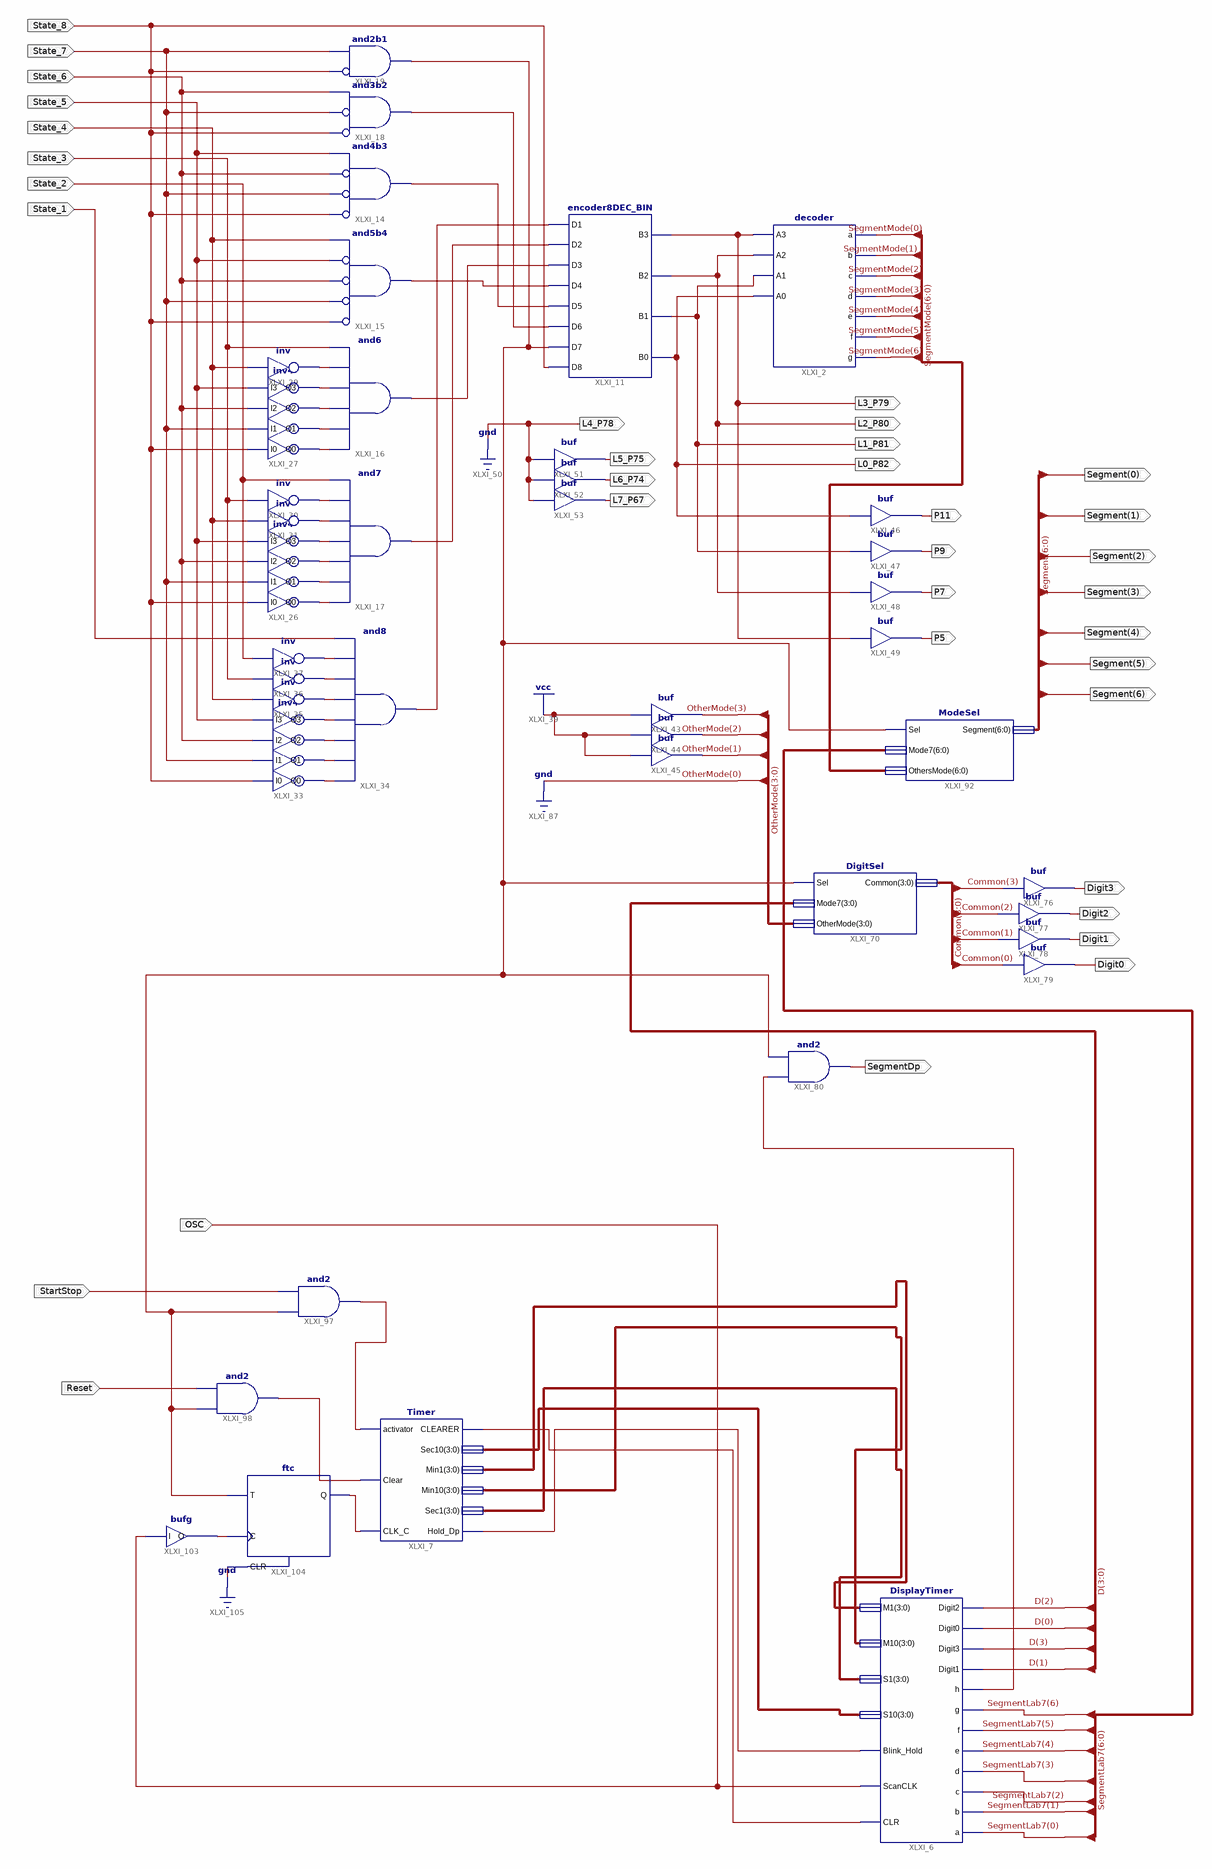
[diagram p0: schematic sheet 1]
// Xilinx ISE schematic Main.sch (spartan6) as structural Verilog: 41 symbols, 35 ports
module Main (
  input  State_7,
  input  State_8,
  input  State_4,
  input  State_5,
  input  State_6,
  input  State_1,
  input  State_2,
  input  State_3,
  input  OSC,
  input  StartStop,
  input  Reset,
  output L1_P81,
  output L0_P82,
  output L2_P80,
  output L3_P79,
  output P11,
  output P9,
  output P7,
  output P5,
  output L4_P78,
  output L5_P75,
  output L6_P74,
  output L7_P67,
  output Digit3,
  output Digit2,
  output Digit1,
  output Digit0,
  output SegmentDp,
  output [6:0] Segment
);

  wire XLXN_28, XLXN_29, XLXN_30, XLXN_31, XLXN_32, XLXN_33, XLXN_34, XLXN_35, XLXN_40, XLXN_41, XLXN_42,
       XLXN_68, XLXN_69, XLXN_70, XLXN_71, XLXN_72, XLXN_73, XLXN_74, XLXN_97, XLXN_98, XLXN_106, XLXN_107,
       XLXN_108, XLXN_109, XLXN_110, XLXN_111, XLXN_183, XLXN_234, XLXN_235, XLXN_236, XLXN_259, XLXN_260;
  wire [3:0] Common, D, XLXN_1, XLXN_2, XLXN_3, XLXN_4;
  wire [3:1] OtherMode;
  wire [6:0] SegmentLab7, SegmentMode;

  decoder XLXI_2 (
    .a(SegmentMode[0]), .b(SegmentMode[1]), .c(SegmentMode[2]), .d(SegmentMode[3]), .e(SegmentMode[4]),
    .f(SegmentMode[5]), .g(SegmentMode[6]), .A3(L3_P79), .A2(L2_P80), .A1(L1_P81), .A0(L0_P82));
  encoder8DEC_BIN XLXI_11 (
    .D1(XLXN_111), .D2(XLXN_110), .D3(XLXN_109), .D4(XLXN_108), .D5(XLXN_107), .D6(XLXN_106), .D7(XLXN_234),
    .D8(State_8), .B3(L3_P79), .B2(L2_P80), .B1(L1_P81), .B0(L0_P82));
  and XLXI_14 (XLXN_107, ~State_8, ~State_7, ~State_6, State_5);  // and4b3
  and XLXI_15 (XLXN_108, ~State_8, ~State_7, ~State_6, ~State_5, State_4);  // and5b4
  and XLXI_16 (XLXN_109, XLXN_32, XLXN_33, XLXN_34, XLXN_35, XLXN_40, State_3);
  and XLXI_17 (XLXN_110, XLXN_28, XLXN_29, XLXN_30, XLXN_31, XLXN_42, XLXN_41, State_2);
  and XLXI_18 (XLXN_106, ~State_8, ~State_7, State_6);  // and3b2
  and XLXI_19 (XLXN_234, ~State_8, State_7);  // and2b1
  inv4 XLXI_26 (
    .I0(State_8), .I1(State_7), .I2(State_6), .I3(State_5), .O0(XLXN_28), .O1(XLXN_29), .O2(XLXN_30),
    .O3(XLXN_31));
  inv4 XLXI_27 (
    .I0(State_8), .I1(State_7), .I2(State_6), .I3(State_5), .O0(XLXN_32), .O1(XLXN_33), .O2(XLXN_34),
    .O3(XLXN_35));
  not XLXI_29 (XLXN_40, State_4);
  not XLXI_30 (XLXN_41, State_3);
  not XLXI_31 (XLXN_42, State_4);
  inv4 XLXI_33 (
    .I0(State_8), .I1(State_7), .I2(State_6), .I3(State_5), .O0(XLXN_68), .O1(XLXN_69), .O2(XLXN_70),
    .O3(XLXN_71));
  and XLXI_34 (XLXN_111, XLXN_68, XLXN_69, XLXN_70, XLXN_71, XLXN_72, XLXN_73, XLXN_74, State_1);
  not XLXI_35 (XLXN_72, State_4);
  not XLXI_36 (XLXN_73, State_3);
  not XLXI_37 (XLXN_74, State_2);
  buf XLXI_46 (P11, L0_P82);
  buf XLXI_47 (P9, L1_P81);
  buf XLXI_48 (P7, L2_P80);
  buf XLXI_49 (P5, L3_P79);
  buf XLXI_51 (L5_P75, 1'b0);
  buf XLXI_52 (L6_P74, 1'b0);
  buf XLXI_53 (L7_P67, 1'b0);
  DigitSel XLXI_70 (.Sel(XLXN_234), .Mode7(D), .OtherMode({OtherMode, 1'b0}), .Common(Common));
  buf XLXI_76 (Digit3, Common[3]);
  buf XLXI_77 (Digit2, Common[2]);
  buf XLXI_78 (Digit1, Common[1]);
  buf XLXI_79 (Digit0, Common[0]);
  buf XLXI_43 (OtherMode[3], 1'b1);
  buf XLXI_44 (OtherMode[2], 1'b1);
  buf XLXI_45 (OtherMode[1], 1'b1);
  and XLXI_80 (SegmentDp, XLXN_183, XLXN_234);
  ModeSel XLXI_92 (.Sel(XLXN_234), .Mode7(SegmentLab7), .OthersMode(SegmentMode), .Segment(Segment));
  DisplayTimer XLXI_6 (
    .M1(XLXN_4), .M10(XLXN_3), .S1(XLXN_1), .S10(XLXN_2), .Blink_Hold(XLXN_98), .ScanCLK(OSC), .CLR(XLXN_97),
    .Digit2(D[2]), .Digit0(D[0]), .Digit3(D[3]), .Digit1(D[1]), .h(XLXN_183), .g(SegmentLab7[6]),
    .f(SegmentLab7[5]), .e(SegmentLab7[4]), .d(SegmentLab7[3]), .c(SegmentLab7[2]), .b(SegmentLab7[1]),
    .a(SegmentLab7[0]));
  Timer XLXI_7 (
    .activator(XLXN_236), .Clear(XLXN_235), .CLK_C(XLXN_260), .CLEARER(XLXN_97), .Sec10(XLXN_2),
    .Min1(XLXN_4), .Min10(XLXN_3), .Sec1(XLXN_1), .Hold_Dp(XLXN_98));
  and XLXI_97 (XLXN_236, XLXN_234, StartStop);
  and XLXI_98 (XLXN_235, XLXN_234, Reset);
  bufg XLXI_103 (.I(OSC), .O(XLXN_259));
  ftc XLXI_104 (.C(XLXN_259), .CLR(1'b0), .T(XLXN_234), .Q(XLXN_260));

  assign L4_P78 = 1'b0;
endmodule
